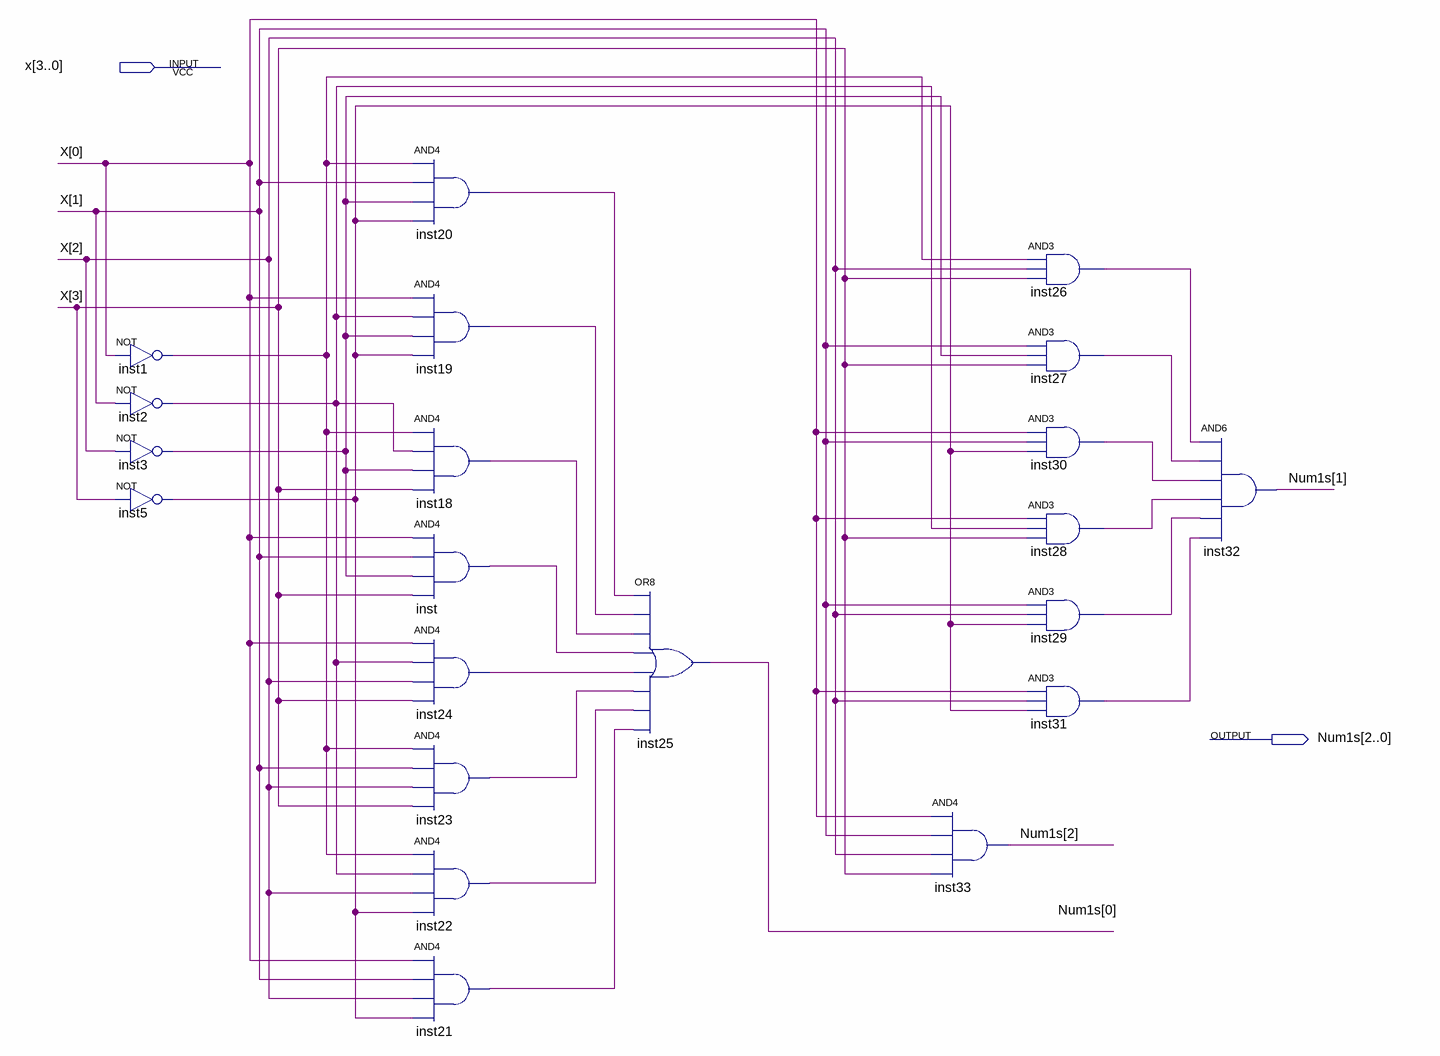
[diagram p0: schematic sheet]
// Quartus schematic g36_schematic_num1s.bdf as structural Verilog: 21 symbols, 2 pins
module g36_schematic_num1s (
  input  [3:0] x,
  output [2:0] Num1s
);

  wire inst1_out, inst2_out, inst3_out, inst5_out, inst18_out, inst19_out, inst20_out, inst21_out,
       inst22_out, inst23_out, inst24_out, inst26_out, inst27_out, inst28_out, inst29_out, inst30_out,
       inst31_out, inst_out;

  not inst1 (inst1_out, x[0]);
  not inst2 (inst2_out, x[1]);
  not inst3 (inst3_out, x[2]);
  not inst5 (inst5_out, x[3]);
  and inst20 (inst20_out, inst1_out, x[1], inst3_out, inst5_out);
  and inst19 (inst19_out, x[0], inst2_out, inst3_out, inst5_out);
  and inst18 (inst18_out, inst1_out, inst2_out, inst3_out, x[3]);
  and inst (inst_out, x[0], x[1], inst3_out, x[3]);
  and inst24 (inst24_out, x[0], inst2_out, x[2], x[3]);
  and inst23 (inst23_out, inst1_out, x[1], x[2], x[3]);
  and inst22 (inst22_out, inst1_out, inst2_out, x[2], inst5_out);
  and inst21 (inst21_out, x[0], x[1], x[2], inst5_out);
  or inst25 (Num1s[0], inst20_out, inst19_out, inst18_out, inst_out, inst24_out, inst23_out, inst22_out, inst21_out);
  and inst33 (Num1s[2], x[0], x[1], x[2], x[3]);
  and inst26 (inst26_out, inst1_out, x[2], x[3]);
  and inst27 (inst27_out, x[1], inst3_out, x[3]);
  and inst30 (inst30_out, x[0], x[1], inst5_out);
  and inst28 (inst28_out, x[0], inst2_out, x[3]);
  and inst29 (inst29_out, x[1], x[2], inst5_out);
  and inst31 (inst31_out, x[0], x[2], inst5_out);
  and inst32 (Num1s[1], inst26_out, inst27_out, inst30_out, inst28_out, inst29_out, inst31_out);
endmodule
